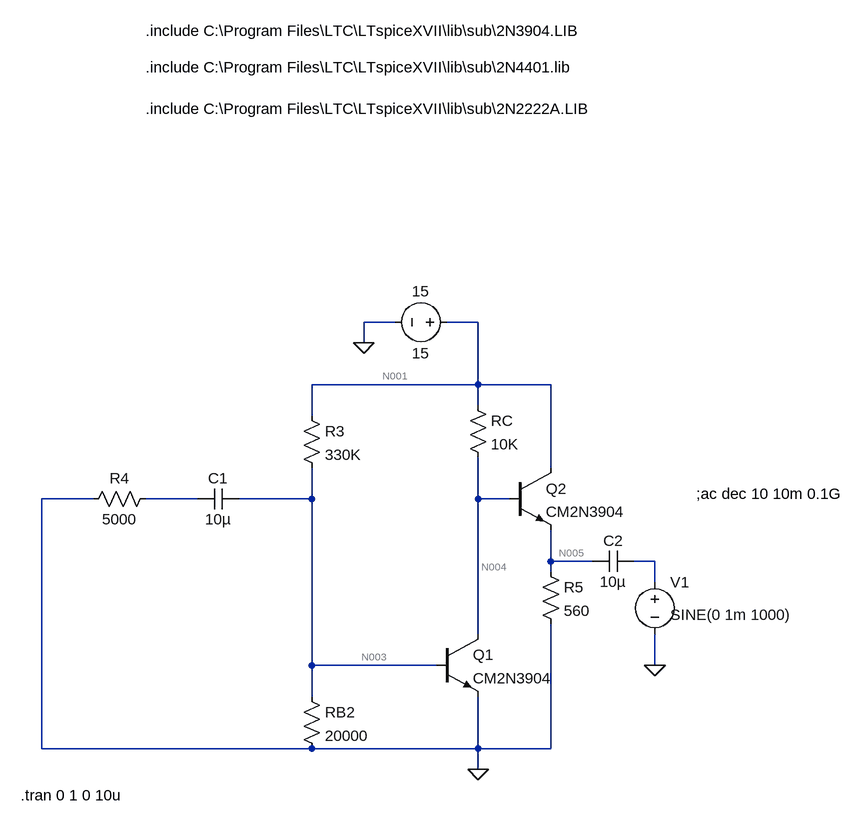
[diagram p0: schematic part C open loop.asc]
part C open loop.asc, the LTspice schematic file:
Version 4
SHEET 1 1076 996
WIRE 48 128 0 128
WIRE 176 128 128 128
WIRE 0 160 0 128
WIRE 176 224 176 128
WIRE 176 224 -80 224
WIRE 288 224 176 224
WIRE 176 256 176 224
WIRE -80 272 -80 224
WIRE 288 352 288 224
WIRE -416 400 -496 400
WIRE -256 400 -336 400
WIRE -80 400 -80 352
WIRE -80 400 -192 400
WIRE 176 400 176 336
WIRE 224 400 176 400
WIRE 288 496 288 448
WIRE 352 496 288 496
WIRE 448 496 416 496
WIRE 288 512 288 496
WIRE 448 528 448 496
WIRE 176 608 176 400
WIRE -80 656 -80 400
WIRE 112 656 -80 656
WIRE 448 656 448 608
WIRE -80 704 -80 656
WIRE -496 784 -496 400
WIRE -80 784 -496 784
WIRE 176 784 176 704
WIRE 176 784 -80 784
WIRE 288 784 288 592
WIRE 288 784 176 784
WIRE 176 816 176 784
FLAG 0 160 0
FLAG 176 816 0
FLAG 448 656 0
SYMBOL npn 112 608 R0
SYMATTR InstName Q1
SYMATTR Value CM2N3904
SYMBOL npn 224 352 R0
SYMATTR InstName Q2
SYMATTR Value CM2N3904
SYMBOL res 160 240 R0
SYMATTR InstName RC
SYMATTR Value 10K
SYMBOL voltage 144 128 R90
WINDOW 0 -32 56 VBottom 2
WINDOW 3 32 56 VTop 2
SYMATTR InstName 15
SYMATTR Value 15
SYMBOL res -96 688 R0
SYMATTR InstName RB2
SYMATTR Value 20000
SYMBOL res -96 256 R0
SYMATTR InstName R3
SYMATTR Value 330K
SYMBOL cap -192 384 R90
WINDOW 0 0 32 VBottom 2
WINDOW 3 32 32 VTop 2
SYMATTR InstName C1
SYMATTR Value 10µ
SYMBOL res -320 384 R90
WINDOW 0 0 56 VBottom 2
WINDOW 3 32 56 VTop 2
SYMATTR InstName R4
SYMATTR Value 5000
SYMBOL res 272 496 R0
SYMATTR InstName R5
SYMATTR Value 560
SYMBOL cap 416 480 R90
WINDOW 0 0 32 VBottom 2
WINDOW 3 32 32 VTop 2
SYMATTR InstName C2
SYMATTR Value 10µ
SYMBOL voltage 448 512 R0
WINDOW 3 24 66 Left 2
WINDOW 123 24 146 Left 2
WINDOW 39 0 0 Left 0
SYMATTR Value SINE(0 1m 1000)
SYMATTR InstName V1
TEXT -336 -200 Left 2 !.include C:\\Program Files\\LTC\\LTspiceXVII\\lib\\sub\\2N2222A.LIB
TEXT -336 -264 Left 2 !.include C:\\Program Files\\LTC\\LTspiceXVII\\lib\\sub\\2N4401.lib
TEXT -336 -320 Left 2 !.include C:\\Program Files\\LTC\\LTspiceXVII\\lib\\sub\\2N3904.LIB
TEXT -528 856 Left 2 !.tran 0 1 0 10u
TEXT 512 392 Left 2 !;ac dec 10 10m 0.1G

The netlist it stands for:
* part C open loop.asc
Q1 N004 N003 0 0 CM2N3904
Q2 N001 N004 N005 0 CM2N3904
RC N001 N004 10K
V§15 N001 0 15
RB2 N003 0 20000
R3 N001 N003 330K
C1 N003 N002 10µ
R4 N002 0 5000
R5 N005 0 560
C2 N006 N005 10µ
V1 N006 0 SINE(0 1m 1000)
.model NPN NPN
.model PNP PNP
.lib standard.bjt
.include C:\Program Files\LTC\LTspiceXVII\lib\sub\2N2222A.LIB
.include C:\Program Files\LTC\LTspiceXVII\lib\sub\2N4401.lib
.include C:\Program Files\LTC\LTspiceXVII\lib\sub\2N3904.LIB
.tran 0 1 0 10u
;ac dec 10 10m 0.1G
.backanno
.end

* Results of the author's LTspice run, read from the files saved beside the schematic
* Operating Point, zero values left out:
*   V(n004) = 1.901 V
*   V(n003) = 654.1 mV
*   V(n001) = 15 V
*   V(n005) = 1.236 V
*   Ic(Q2) = 2.192 mA
*   Ib(Q2) = 15.4 µA
*   Ie(Q2) = -2.207 mA
*   Ic(Q1) = 1.294 mA
*   Ib(Q1) = 10.77 µA
*   Ie(Q1) = -1.305 mA
*   I(R5) = 2.207 mA
*   I(R3) = 43.47 µA
*   I(Rb2) = 32.7 µA
*   I(Rc) = 1.31 mA
*   I(15) = -3.545 mA